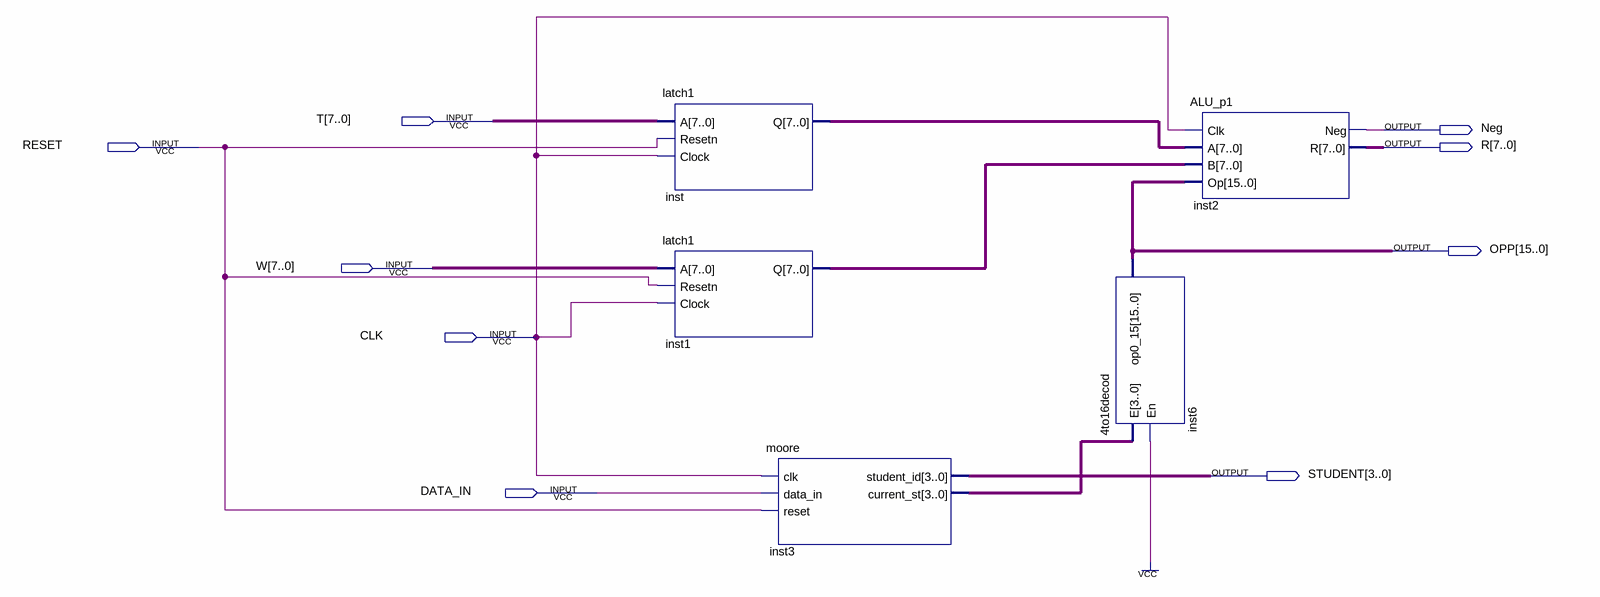
[diagram p0: schematic sheet]
// Quartus schematic WALUP1.bdf as structural Verilog: 5 symbols, 9 pins
module WALUP1 (
  input  [7:0] T,
  input  RESET,
  input  [7:0] W,
  input  CLK,
  input  DATA_IN,
  output Neg,
  output [7:0] R,
  output [15:0] OPP,
  output [3:0] STUDENT
);

  wire [3:0] inst3_current_st;
  wire [7:0] inst1_q, inst_q;

  latch1 inst (.A(T), .Resetn(RESET), .Clock(CLK), .Q(inst_q));
  latch1 inst1 (.A(W), .Resetn(RESET), .Clock(CLK), .Q(inst1_q));
  moore inst3 (.clk(CLK), .data_in(DATA_IN), .reset(RESET), .student_id(STUDENT), .current_st(inst3_current_st));
  \4to16decod  inst6 (.E(inst3_current_st), .En(1'b1), .op0_15(OPP));
  ALU_p1 inst2 (.Clk(CLK), .A(inst_q), .B(inst1_q), .Op(OPP), .Neg(Neg), .R(R));
endmodule
